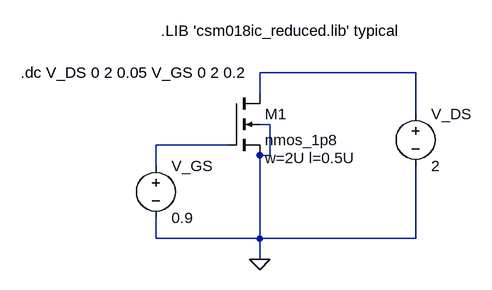
[diagram p0: schematic nmos.asc]
nmos.asc, the LTspice schematic file:
Version 4
SHEET 1 880 680
WIRE 400 192 160 192
WIRE 160 224 160 192
WIRE 400 256 400 192
WIRE 176 272 160 272
WIRE 112 304 0 304
WIRE 176 320 176 272
WIRE 176 320 160 320
WIRE 0 336 0 304
WIRE 0 448 0 416
WIRE 160 448 160 320
WIRE 160 448 0 448
WIRE 400 448 400 336
WIRE 400 448 160 448
WIRE 160 480 160 448
FLAG 160 480 0
SYMBOL nmos4 112 224 R0
WINDOW 123 56 100 Left 2
SYMATTR Value2 w=2U l=0.5U
SYMATTR InstName M1
SYMATTR Value nmos_1p8
SYMBOL voltage 0 320 R0
WINDOW 123 0 0 Left 0
WINDOW 39 0 0 Left 0
SYMATTR InstName V_GS
SYMATTR Value 0.9
SYMBOL voltage 400 240 R0
WINDOW 123 0 0 Left 0
WINDOW 39 0 0 Left 0
SYMATTR InstName V_DS
SYMATTR Value 2
TEXT 8 128 Left 2 !.LIB 'csm018ic_reduced.lib' typical
TEXT -208 192 Left 2 !.dc V_DS 0 2 0.05 V_GS 0 2 0.2

The netlist it stands for:
* nmos.asc
M1 N001 N002 0 0 nmos_1p8 w=2U l=0.5U
V_GS N002 0 0.9
V_DS N001 0 2
.model NMOS NMOS
.model PMOS PMOS
.lib standard.mos
.LIB 'csm018ic_reduced.lib' typical
.dc V_DS 0 2 0.05 V_GS 0 2 0.2
.backanno
.end